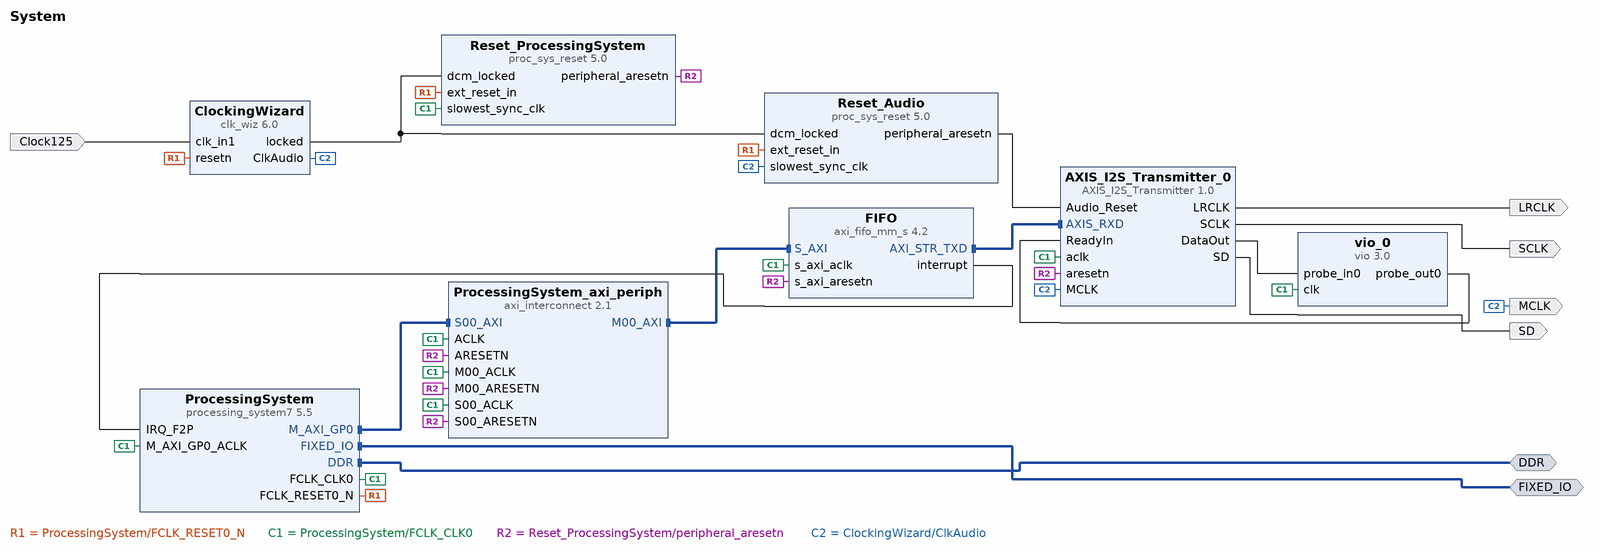
[diagram p0: block diagram of the top level]
# Vivado block design System, xc7z010clg400-1, Vivado 2019.2
create_bd_design System

create_bd_intf_port -mode Master -vlnv xilinx.com:interface:ddrx_rtl:1.0 DDR
create_bd_intf_port -mode Master -vlnv xilinx.com:display_processing_system7:fixedio_rtl:1.0 FIXED_IO
create_bd_port -dir I -type clk Clock125
set_property -dict {CONFIG.FREQ_HZ 125000000} [get_bd_ports Clock125]
create_bd_port -dir O LRCLK
create_bd_port -dir O SCLK
create_bd_port -dir O SD
create_bd_port -dir O -type clk MCLK
set_property -dict {CONFIG.FREQ_HZ 12288013} [get_bd_ports MCLK]

create_bd_cell -type ip -vlnv xilinx.com:ip:processing_system7:5.5 ProcessingSystem
set_property -dict [list \
  CONFIG.PCW_APU_PERIPHERAL_FREQMHZ 650.000000 \
  CONFIG.PCW_CRYSTAL_PERIPHERAL_FREQMHZ 50.000000 \
  CONFIG.PCW_ENET0_PERIPHERAL_ENABLE 0 \
  CONFIG.PCW_FCLK1_PERIPHERAL_CLKSRC {DDR PLL} \
  CONFIG.PCW_FCLK2_PERIPHERAL_CLKSRC {ARM PLL} \
  CONFIG.PCW_FPGA0_PERIPHERAL_FREQMHZ 100.000000 \
  CONFIG.PCW_FPGA1_PERIPHERAL_FREQMHZ 175.000000 \
  CONFIG.PCW_FPGA2_PERIPHERAL_FREQMHZ 12.288000 \
  CONFIG.PCW_FPGA3_PERIPHERAL_FREQMHZ 100.000000 \
  CONFIG.PCW_GPIO_MIO_GPIO_ENABLE 0 \
  CONFIG.PCW_GPIO_PERIPHERAL_ENABLE 1 \
  CONFIG.PCW_IMPORT_BOARD_PRESET D:/Downloads/Zybo.xml \
  CONFIG.PCW_IRQ_F2P_INTR 1 \
  CONFIG.PCW_PRESET_BANK1_VOLTAGE {LVCMOS 1.8V} \
  CONFIG.PCW_QSPI_PERIPHERAL_ENABLE 0 \
  CONFIG.PCW_SD0_PERIPHERAL_ENABLE 0 \
  CONFIG.PCW_UART1_PERIPHERAL_ENABLE 1 \
  CONFIG.PCW_UART1_UART1_IO {MIO 48 .. 49} \
  CONFIG.PCW_UART_PERIPHERAL_FREQMHZ 50 \
  CONFIG.PCW_UIPARAM_DDR_FREQ_MHZ 525.000000 \
  CONFIG.PCW_UIPARAM_DDR_PARTNO {MT41K128M16 JT-125} \
  CONFIG.PCW_USB0_PERIPHERAL_ENABLE 0 \
  CONFIG.PCW_USE_FABRIC_INTERRUPT 1 \
] [get_bd_cells ProcessingSystem]
# 272 more settings of ProcessingSystem are not shown: defaults, MIO pin electricals, DDR timing, and values the tool derives
create_bd_cell -type ip -vlnv xilinx.com:ip:axi_fifo_mm_s:4.2 FIFO
set_property -dict {CONFIG.C_TX_FIFO_PE_THRESHOLD 5 CONFIG.C_USE_RX_DATA 0 CONFIG.C_USE_TX_CTRL 0} [get_bd_cells FIFO]
create_bd_cell -type ip -vlnv xilinx.com:ip:proc_sys_reset:5.0 Reset_ProcessingSystem
create_bd_cell -type ip -vlnv xilinx.com:ip:clk_wiz:6.0 ClockingWizard
set_property -dict [list \
  CONFIG.CLKOUT1_JITTER 473.813 \
  CONFIG.CLKOUT1_PHASE_ERROR 351.816 \
  CONFIG.CLKOUT1_REQUESTED_OUT_FREQ 12.288 \
  CONFIG.CLK_OUT1_PORT ClkAudio \
  CONFIG.MMCM_CLKFBOUT_MULT_F 42.750 \
  CONFIG.MMCM_CLKOUT0_DIVIDE_F 62.125 \
  CONFIG.MMCM_DIVCLK_DIVIDE 7 \
  CONFIG.RESET_PORT resetn \
  CONFIG.RESET_TYPE ACTIVE_LOW \
  CONFIG.USE_RESET true \
] [get_bd_cells ClockingWizard]
create_bd_cell -type ip -vlnv xilinx.com:ip:proc_sys_reset:5.0 Reset_Audio
create_bd_cell -type ip -vlnv xilinx.com:ip:axi_interconnect:2.1 ProcessingSystem_axi_periph
set_property -dict {CONFIG.NUM_MI 1} [get_bd_cells ProcessingSystem_axi_periph]
create_bd_cell -type ip -vlnv xilinx.com:ip:vio:3.0 vio_0
set_property -dict {CONFIG.C_NUM_PROBE_OUT 1} [get_bd_cells vio_0]
create_bd_cell -type ip -vlnv www.Kampis-Elektroecke.com:Kampis-Elektroecke:AXIS_I2S_Transmitter:1.0 AXIS_I2S_Transmitter_0

# ---- connections ----

connect_bd_intf_net [get_bd_intf_ports FIXED_IO] [get_bd_intf_pins ProcessingSystem/FIXED_IO]
connect_bd_intf_net [get_bd_intf_pins ProcessingSystem/M_AXI_GP0] [get_bd_intf_pins ProcessingSystem_axi_periph/S00_AXI]
connect_bd_intf_net [get_bd_intf_pins ProcessingSystem_axi_periph/M00_AXI] [get_bd_intf_pins FIFO/S_AXI]
connect_bd_intf_net [get_bd_intf_ports DDR] [get_bd_intf_pins ProcessingSystem/DDR]
connect_bd_intf_net [get_bd_intf_pins FIFO/AXI_STR_TXD] [get_bd_intf_pins AXIS_I2S_Transmitter_0/AXIS_RXD]
connect_bd_net [get_bd_pins FIFO/interrupt] [get_bd_pins ProcessingSystem/IRQ_F2P]
connect_bd_net -net clk_in1_0_1 [get_bd_ports Clock125] [get_bd_pins ClockingWizard/clk_in1]
connect_bd_net [get_bd_pins ClockingWizard/locked] [get_bd_pins Reset_ProcessingSystem/dcm_locked] [get_bd_pins Reset_Audio/dcm_locked]
connect_bd_net [get_bd_pins ProcessingSystem/FCLK_RESET0_N] \
  [get_bd_pins Reset_ProcessingSystem/ext_reset_in] [get_bd_pins ClockingWizard/resetn] \
  [get_bd_pins Reset_Audio/ext_reset_in]
connect_bd_net [get_bd_pins AXIS_I2S_Transmitter_0/LRCLK] [get_bd_ports LRCLK]
connect_bd_net [get_bd_pins AXIS_I2S_Transmitter_0/SCLK] [get_bd_ports SCLK]
connect_bd_net [get_bd_pins AXIS_I2S_Transmitter_0/SD] [get_bd_ports SD]
connect_bd_net [get_bd_pins Reset_Audio/peripheral_aresetn] [get_bd_pins AXIS_I2S_Transmitter_0/Audio_Reset]
connect_bd_net [get_bd_pins ProcessingSystem/FCLK_CLK0] \
  [get_bd_pins FIFO/s_axi_aclk] [get_bd_pins Reset_ProcessingSystem/slowest_sync_clk] \
  [get_bd_pins ProcessingSystem_axi_periph/M00_ACLK] [get_bd_pins ProcessingSystem/M_AXI_GP0_ACLK] \
  [get_bd_pins ProcessingSystem_axi_periph/S00_ACLK] [get_bd_pins ProcessingSystem_axi_periph/ACLK] [get_bd_pins vio_0/clk] \
  [get_bd_pins AXIS_I2S_Transmitter_0/aclk]
connect_bd_net [get_bd_pins Reset_ProcessingSystem/peripheral_aresetn] \
  [get_bd_pins FIFO/s_axi_aresetn] [get_bd_pins ProcessingSystem_axi_periph/M00_ARESETN] \
  [get_bd_pins ProcessingSystem_axi_periph/S00_ARESETN] [get_bd_pins ProcessingSystem_axi_periph/ARESETN] \
  [get_bd_pins AXIS_I2S_Transmitter_0/aresetn]
connect_bd_net [get_bd_pins ClockingWizard/ClkAudio] \
  [get_bd_ports MCLK] [get_bd_pins Reset_Audio/slowest_sync_clk] [get_bd_pins AXIS_I2S_Transmitter_0/MCLK]
connect_bd_net [get_bd_pins AXIS_I2S_Transmitter_0/DataOut] [get_bd_pins vio_0/probe_in0]
connect_bd_net [get_bd_pins vio_0/probe_out0] [get_bd_pins AXIS_I2S_Transmitter_0/ReadyIn]

# ---- address map ----
assign_bd_address -offset 0x43C00000 -range 64K -target_address_space [get_bd_addr_spaces ProcessingSystem/Data] [get_bd_addr_segs FIFO/S_AXI/Mem0]

validate_bd_design
save_bd_design
